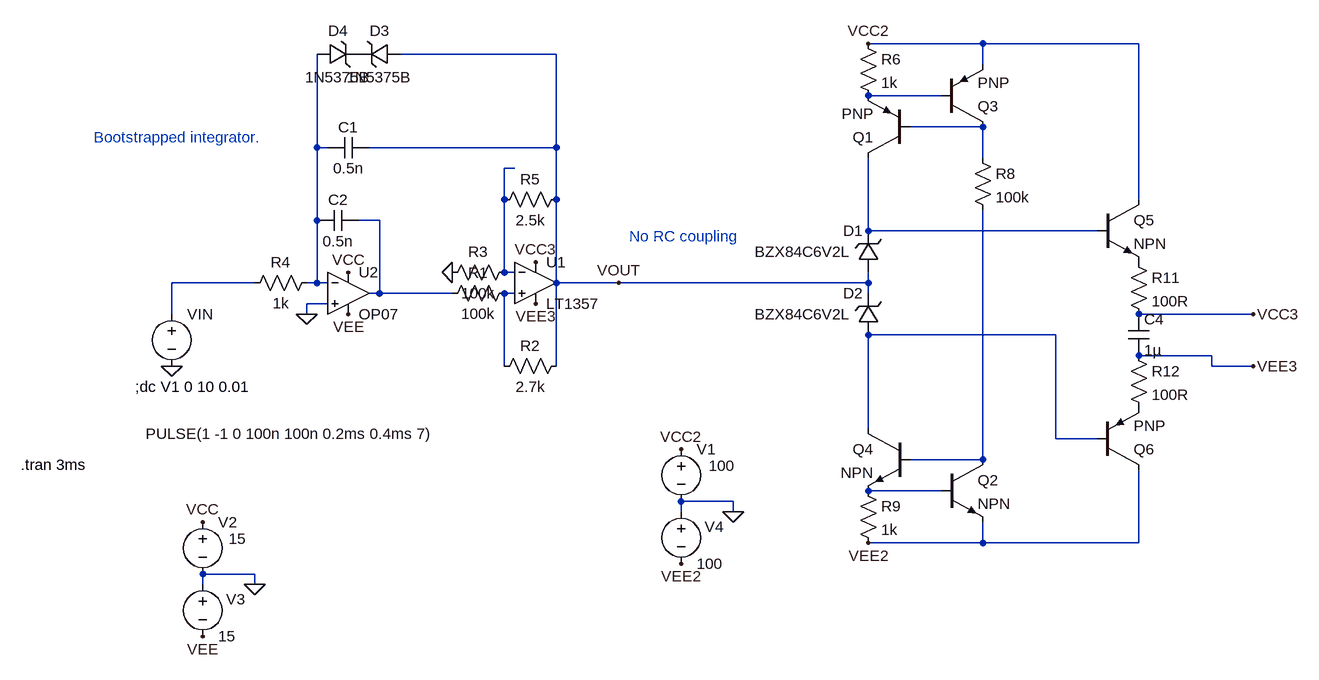
[diagram p0: schematic Draft41.asc]
Draft41.asc, the LTspice schematic file:
Version 4
SHEET 1 1440 868
WIRE 880 -192 704 -192
WIRE 1120 -192 880 -192
WIRE 224 -176 -16 -176
WIRE 880 -160 880 -192
WIRE 816 -112 704 -112
WIRE 880 -64 768 -64
WIRE -144 -32 -144 -176
WIRE -128 -32 -144 -32
WIRE 224 -32 224 -176
WIRE 224 -32 -64 -32
WIRE 880 -16 880 -64
WIRE 160 0 144 0
WIRE 144 48 144 0
WIRE 224 48 224 -32
WIRE 1120 48 1120 -192
WIRE -144 80 -144 -32
WIRE -48 80 -80 80
WIRE 704 96 704 -16
WIRE 1056 96 704 96
WIRE 144 160 144 48
WIRE 160 160 144 160
WIRE -240 176 -368 176
WIRE -144 176 -144 80
WIRE -144 176 -160 176
WIRE -128 176 -144 176
WIRE 224 176 224 48
WIRE 320 176 224 176
WIRE 704 176 704 160
WIRE 704 176 320 176
WIRE -48 192 -48 80
WIRE -48 192 -64 192
WIRE 64 192 -48 192
WIRE 160 192 144 192
WIRE 704 192 704 176
WIRE -128 208 -160 208
WIRE -368 224 -368 176
WIRE -160 224 -160 208
WIRE 1296 224 1120 224
WIRE 992 256 704 256
WIRE 1232 288 1120 288
WIRE 144 304 144 192
WIRE 224 304 224 176
WIRE 1232 304 1232 288
WIRE 1296 304 1232 304
WIRE 704 400 704 256
WIRE 992 416 992 256
WIRE 1056 416 992 416
WIRE 880 448 880 64
WIRE 880 448 768 448
WIRE 816 496 704 496
WIRE 496 512 416 512
WIRE 416 528 416 512
WIRE 496 528 496 512
WIRE 880 576 880 544
WIRE 880 576 704 576
WIRE 1120 576 1120 464
WIRE 1120 576 880 576
WIRE -240 624 -320 624
WIRE -320 640 -320 624
WIRE -240 640 -240 624
FLAG -368 304 0
FLAG -240 640 0
FLAG 320 176 VOUT
FLAG -160 224 0
FLAG 496 528 0
FLAG 416 432 VCC2
FLAG 416 608 VEE2
FLAG 704 -192 VCC2
FLAG 704 576 VEE2
FLAG 1296 224 VCC3
FLAG 1296 304 VEE3
FLAG -320 544 VCC
FLAG -320 720 VEE
FLAG 192 208 VEE3
FLAG 192 144 VCC3
FLAG 64 160 0
FLAG -96 160 VCC
FLAG -96 224 VEE
SYMBOL voltage -368 208 R0
WINDOW 123 0 0 Left 0
WINDOW 39 0 0 Left 0
WINDOW 3 -40 200 Left 2
SYMATTR Value PULSE(1 -1 0 100n 100n 0.2ms 0.4ms 7)
SYMATTR InstName VIN
SYMBOL voltage -320 528 R0
WINDOW 123 0 0 Left 0
WINDOW 39 0 0 Left 0
WINDOW 3 40 42 Left 2
SYMATTR Value 15
SYMATTR InstName V2
SYMBOL voltage -320 624 R0
WINDOW 123 0 0 Left 0
WINDOW 39 0 0 Left 0
WINDOW 0 36 39 Left 2
SYMATTR InstName V3
SYMATTR Value 15
SYMBOL cap -64 -48 R90
WINDOW 0 0 32 VBottom 2
WINDOW 3 32 32 VTop 2
SYMATTR InstName C1
SYMATTR Value 0.5n
SYMBOL res -144 160 R90
WINDOW 0 0 56 VBottom 2
WINDOW 3 32 56 VTop 2
SYMATTR InstName R4
SYMATTR Value 1k
SYMBOL cap -144 96 R270
WINDOW 0 32 32 VTop 2
WINDOW 3 0 32 VBottom 2
SYMATTR InstName C2
SYMATTR Value 0.5n
SYMBOL pnp 768 -16 R180
SYMATTR InstName Q1
SYMBOL pnp 816 -64 M180
SYMATTR InstName Q3
SYMBOL res 688 -208 R0
SYMATTR InstName R6
SYMATTR Value 1k
SYMBOL voltage 416 416 R0
WINDOW 123 0 0 Left 0
WINDOW 39 0 0 Left 0
WINDOW 3 42 41 Left 2
SYMATTR Value 100
SYMATTR InstName V1
SYMBOL voltage 416 512 R0
WINDOW 123 0 0 Left 0
WINDOW 39 0 0 Left 0
WINDOW 0 36 39 Left 2
SYMATTR InstName V4
SYMATTR Value 100
SYMBOL npn 816 448 R0
SYMATTR InstName Q2
SYMBOL npn 768 400 M0
SYMATTR InstName Q4
SYMBOL res 864 -32 R0
SYMATTR InstName R8
SYMATTR Value 100k
SYMBOL res 688 480 R0
SYMATTR InstName R9
SYMATTR Value 1k
SYMBOL zener 720 160 R180
WINDOW 0 24 64 Left 2
WINDOW 3 44 32 Left 2
SYMATTR InstName D1
SYMATTR Value BZX84C6V2L
SYMBOL zener 720 256 R180
WINDOW 0 24 64 Left 2
WINDOW 3 44 32 Left 2
SYMATTR InstName D2
SYMATTR Value BZX84C6V2L
SYMBOL npn 1056 48 R0
SYMATTR InstName Q5
SYMBOL res 1104 128 R0
SYMATTR InstName R11
SYMATTR Value 100R
SYMBOL res 1104 272 R0
SYMATTR InstName R12
SYMATTR Value 100R
SYMBOL cap 1104 224 R0
SYMATTR InstName C4
SYMATTR Value 1µ
SYMBOL pnp 1056 464 M180
SYMATTR InstName Q6
SYMBOL res 160 176 R90
WINDOW 0 0 56 VBottom 2
WINDOW 3 32 56 VTop 2
SYMATTR InstName R1
SYMATTR Value 100k
SYMBOL res 240 288 R90
WINDOW 0 0 56 VBottom 2
WINDOW 3 32 56 VTop 2
SYMATTR InstName R2
SYMATTR Value 2.7k
SYMBOL res 160 144 R90
WINDOW 0 0 56 VBottom 2
WINDOW 3 32 56 VTop 2
SYMATTR InstName R3
SYMATTR Value 100k
SYMBOL res 240 32 R90
WINDOW 0 0 56 VBottom 2
WINDOW 3 32 56 VTop 2
SYMATTR InstName R5
SYMATTR Value 2.5k
SYMBOL OpAmps\\OP07 -96 128 R0
SYMATTR InstName U2
SYMBOL zener -144 -160 R270
WINDOW 0 36 32 VTop 2
WINDOW 3 -4 32 VBottom 2
SYMATTR InstName D4
SYMATTR Value 1N5375B
SYMBOL OpAmps\\LT1357 192 112 R0
SYMATTR InstName U1
SYMBOL zener -16 -192 R90
WINDOW 0 -4 32 VBottom 2
WINDOW 3 36 32 VTop 2
SYMATTR InstName D3
SYMATTR Value 1N5375B
TEXT -424 336 Left 2 !;dc V1 0 10 0.01
TEXT -600 456 Left 2 !.tran 3ms
TEXT -488 -48 Left 2 ;Bootstrapped integrator.
TEXT 336 104 Left 2 ;No RC coupling

The netlist it stands for:
* Draft41.asc
VIN N007 0 PULSE(1 -1 0 100n 100n 0.2ms 0.4ms 7)
V2 VCC 0 15
V3 0 VEE 15
C1 VOUT N003 0.5n
R4 N003 N007 1k
C2 N003 N005 0.5n
Q1 N006 N002 N001 0 PNP
Q3 N002 N001 VCC2 0 PNP
R6 VCC2 N001 1k
V1 VCC2 0 100
V4 0 VEE2 100
Q2 N010 N011 VEE2 0 NPN
Q4 N009 N010 N011 0 NPN
R8 N002 N010 100k
R9 N011 VEE2 1k
D1 VOUT N006 BZX84C6V2L
D2 N009 VOUT BZX84C6V2L
Q5 VCC2 N006 P001 0 NPN
R11 P001 VCC3 100R
R12 VEE3 P002 100R
C4 VCC3 VEE3 1µ
Q6 VEE2 N009 P002 0 PNP
R1 N008 N005 100k
R2 VOUT N008 2.7k
R3 N004 0 100k
R5 VOUT N004 2.5k
XU2 0 N003 VCC VEE N005 LT1001  ; OP07, pins In+ In- V+ V- OUT
D4 N003 P003 1N5375B
XU1 N008 N004 VCC3 VEE3 VOUT LT1357  ; pins In+ In- V+ V- OUT
D3 VOUT P003 1N5375B
.model D D
.lib standard.dio
.model NPN NPN
.model PNP PNP
.lib standard.bjt
;dc V1 0 10 0.01
.tran 3ms
* Bootstrapped integrator.
* No RC coupling
.lib LTC.lib
.backanno
.end